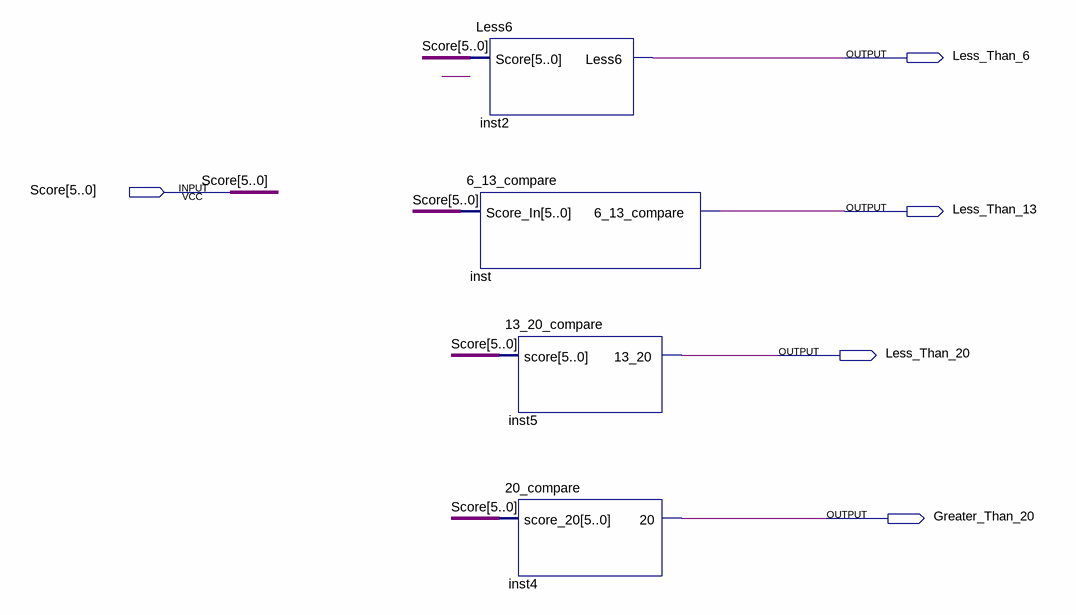
[diagram p0: schematic sheet]
// Quartus schematic CompareScore.bdf as structural Verilog: 4 symbols, 5 pins
module CompareScore (
  input  [5:0] Score,
  output Less_Than_6,
  output Less_Than_13,
  output Less_Than_20,
  output Greater_Than_20
);

  Less6 inst2 (.Score(Score), .Less6(Less_Than_6));
  \6_13_compare  inst (.Score_In(Score), .\6_13_compare (Less_Than_13));
  \13_20_compare  inst5 (.score(Score), .\13_20 (Less_Than_20));
  \20_compare  inst4 (.score_20(Score), .\20 (Greater_Than_20));
endmodule
